# Altium project Obscurum-MB_1a.PrjPcb
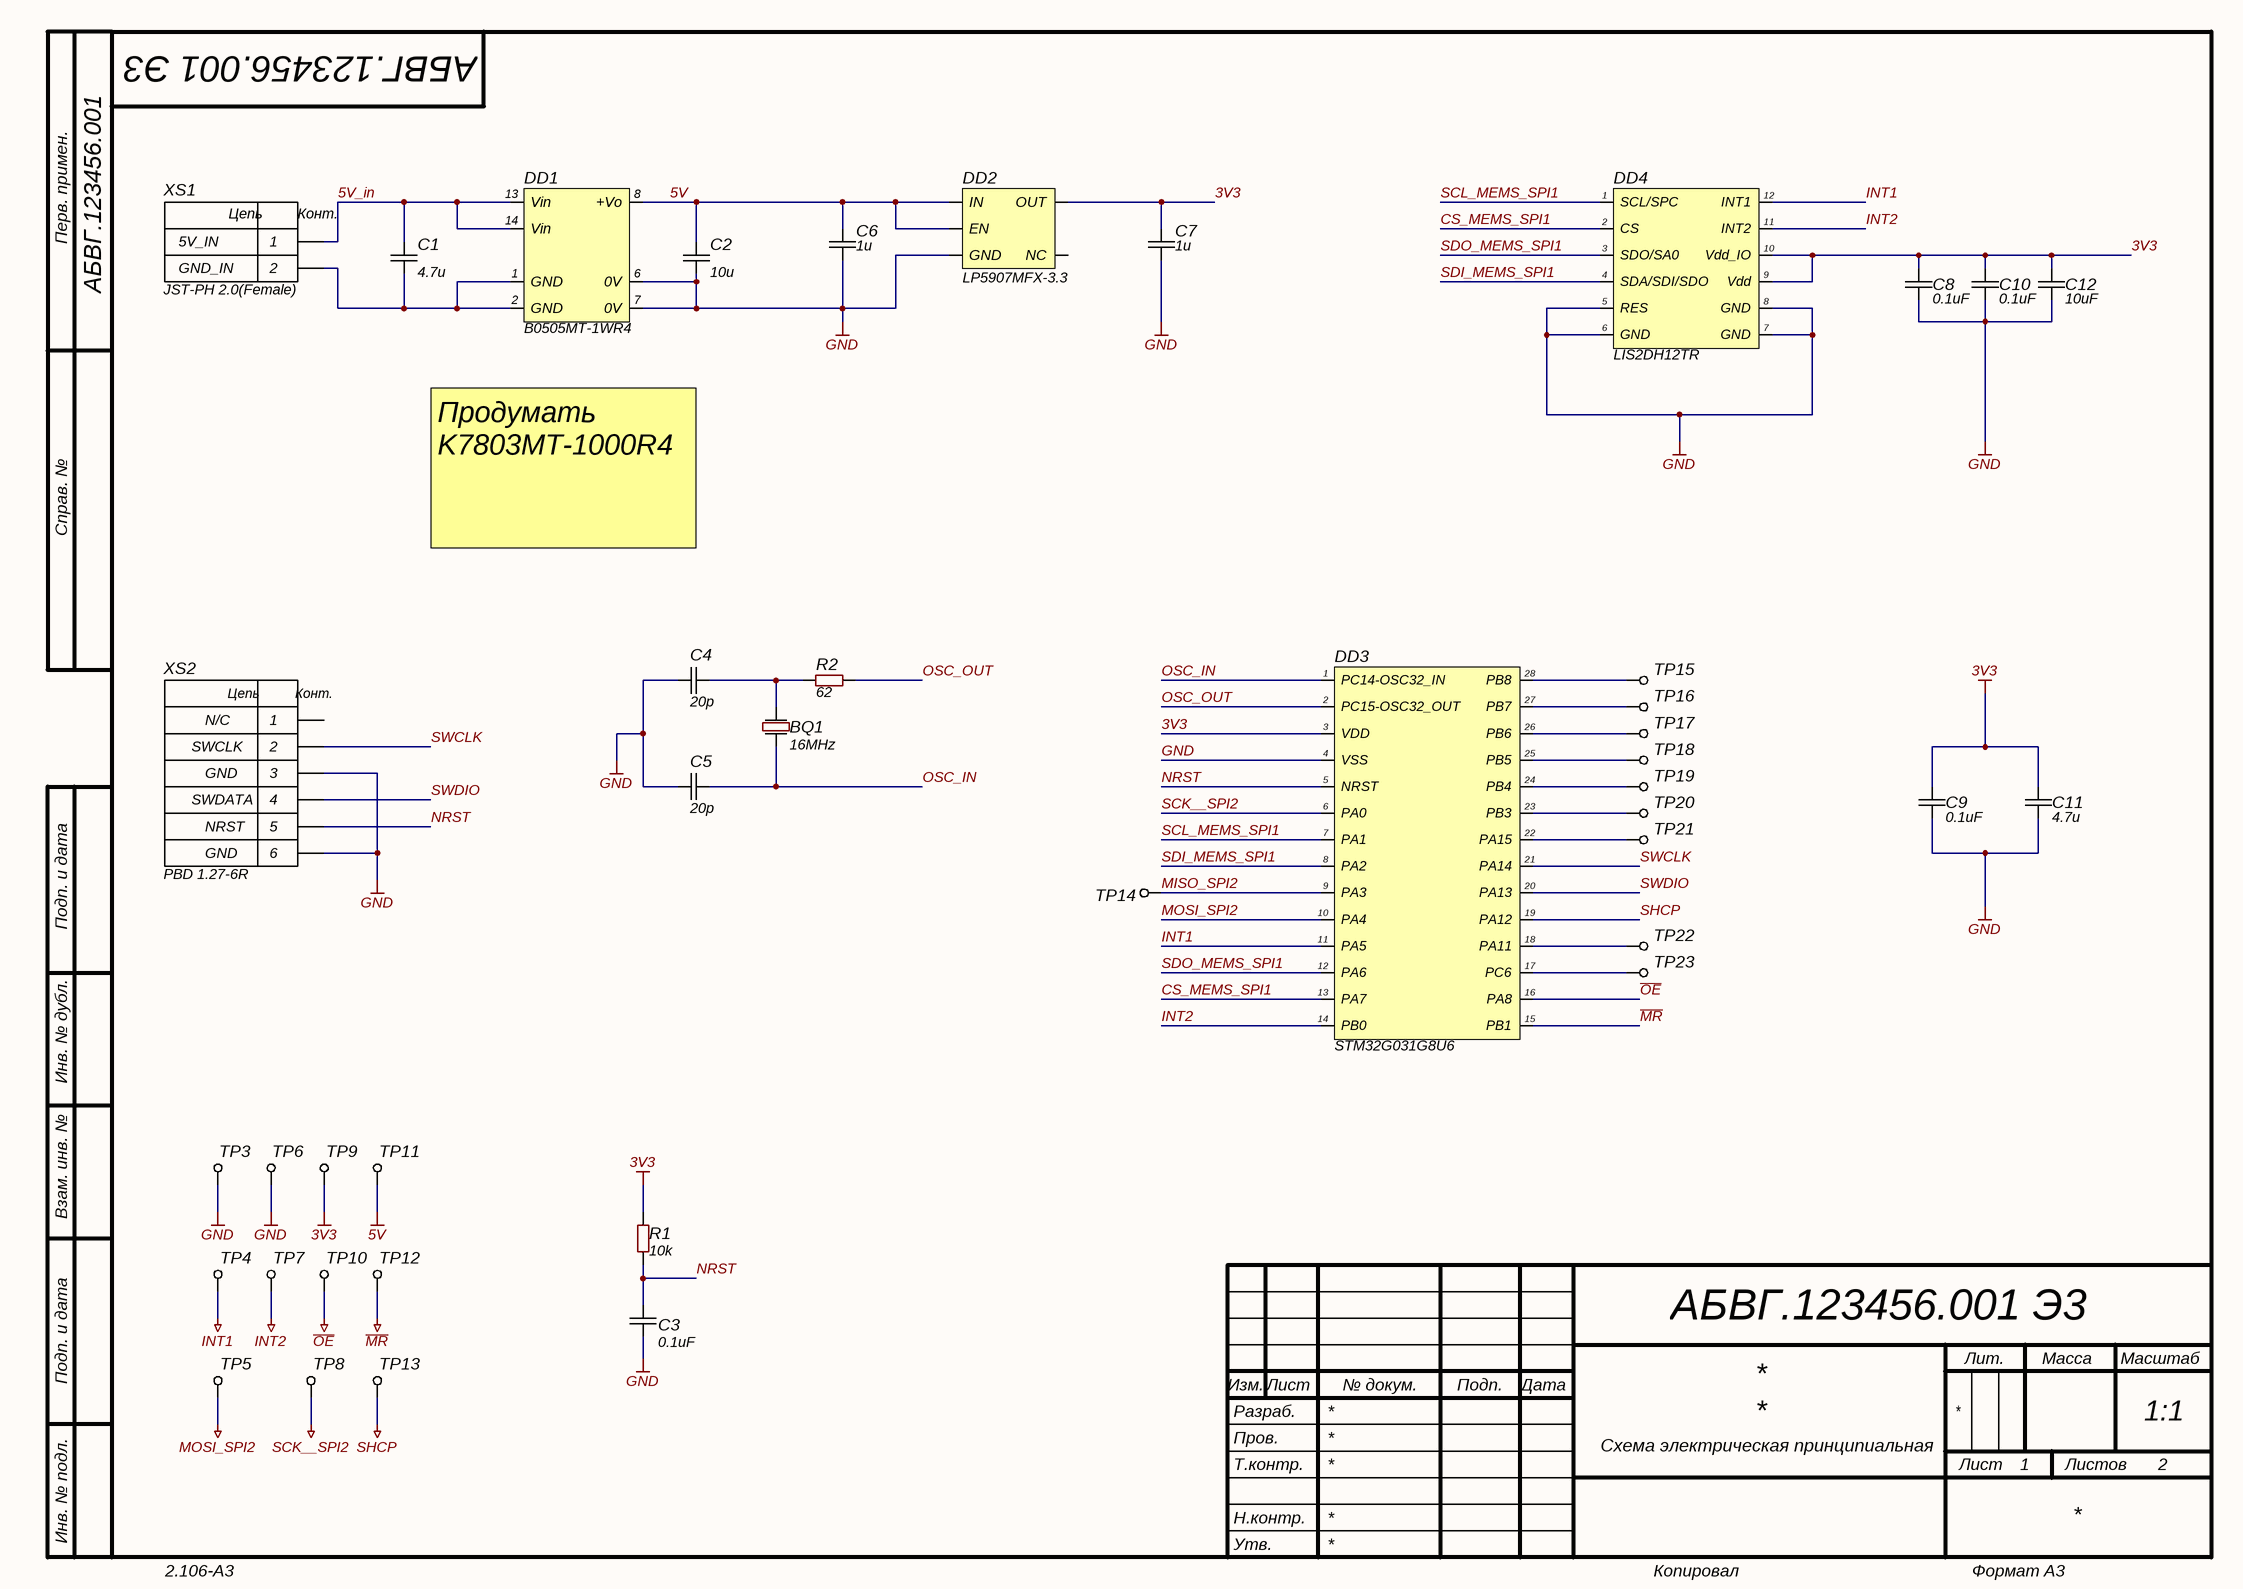
[diagram p0: PWR_MCU.SchDoc]
2 sheets, 135 parts. Net scope: global (net labels, ports and power ports of the same name join across sheets).
Board file: Obscurum-MB_1a.PcbDoc
Sheets:
  PWR_MCU.SchDoc
  LED.SchDoc

## Sheet PWR_MCU.SchDoc
size 420 x 297 mm; Address1: Address1; Address2: Address2; Address3: Address3; Address4: Address4; DocumentNumber: АБВГ.123456.001 Э3; SheetNumber: 1; SheetTotal: 2; Scale: 1:1; DocumentType: Схема электрическая принципиальная; FirstReferrence: АБВГ.123456.001

### Parts
BQ1  Frequency: 16MHz  [OSC: 3225]  (hidden comment: SMD3225-16.000MHz)
C1  value 4.7u  [CAP: 0805]
C2  value 10u  [CAP: 0805]
C3  value 0.1uF  [CAP: 0603]
C4  value 20p  [CAP: 0603]  (hidden comment: 0603   20 пФ ± 10 % X7R 10В)
C5  value 20p  [CAP: 0603]  (hidden comment: 0603   20 пФ ± 10 % X7R 10В)
C6  value 1u  [CAP: 0603]  (hidden comment: 0603   1 мкФ ± 10 % X7R 16В)
C7  value 1u  [CAP: 0603]  (hidden comment: 0603   1 мкФ ± 10 % X7R 16В)
C8  value 0.1uF  [CAP: 0603]
C9  value 0.1uF  [CAP: 0603]
C10  value 0.1uF  [CAP: 0603]
C11  value 4.7u  [CAP: 0603]
C12  value 10uF  [CAP: 0603]
DD1  B0505MT-1WR4  [B0505MT-1WR4]
DD2  LP5907MFX-3.3  [SOT23-5]
DD3  STM32G031G8U6  [28-UFQFPN]
DD4  LIS2DH12TR  [12-LGA]
R1  value 10k  [RES: 0603]
R2  value 62  [RES: 0603]  (hidden comment: 0603 62 Ом ± 5 %)
TP3  Testpoint_HS1mm  [TestPoint(without hole)]  (value not drawn)
TP4  Testpoint_HS1mm  [TestPoint(without hole)]  (value not drawn)
TP5  Testpoint_HS1mm  [TestPoint(without hole)]  (value not drawn)
TP6  Testpoint_HS1mm  [TestPoint(without hole)]  (value not drawn)
TP7  Testpoint_HS1mm  [TestPoint(without hole)]  (value not drawn)
TP8  Testpoint_HS1mm  [TestPoint(without hole)]  (value not drawn)
TP9  Testpoint_HS1mm  [TestPoint(without hole)]  (value not drawn)
TP10  Testpoint_HS1mm  [TestPoint(without hole)]  (value not drawn)
TP11  Testpoint_HS1mm  [TestPoint(without hole)]  (value not drawn)
TP12  Testpoint_HS1mm  [TestPoint(without hole)]  (value not drawn)
TP13  Testpoint_HS1mm  [TestPoint(without hole)]  (value not drawn)
TP14  Testpoint_HS1mm  [TestPoint(without hole)]  (value not drawn)
TP15  Testpoint_HS1mm  [TestPoint(without hole)]  (value not drawn)
TP16  Testpoint_HS1mm  [TestPoint(without hole)]  (value not drawn)
TP17  Testpoint_HS1mm  [TestPoint(without hole)]  (value not drawn)
TP18  Testpoint_HS1mm  [TestPoint(without hole)]  (value not drawn)
TP19  Testpoint_HS1mm  [TestPoint(without hole)]  (value not drawn)
TP20  Testpoint_HS1mm  [TestPoint(without hole)]  (value not drawn)
TP21  Testpoint_HS1mm  [TestPoint(without hole)]  (value not drawn)
TP22  Testpoint_HS1mm  [TestPoint(without hole)]  (value not drawn)
TP23  Testpoint_HS1mm  [TestPoint(without hole)]  (value not drawn)
XS1  JST-PH 2.0(Female)  [JST-PH 2.0(Female)]
XS2  PBD 1.27-6R  [CON: PLLD-6R(1.27)]

### Nets
3V3: C7.2 C8.2 C9.2 C10.2 C11.2 C12.2 DD2.5(OUT) DD3.3(VDD) DD4.9(Vdd) DD4.10(Vdd_IO) R1.2 TP9.1
5V: C2.2 C6.2 DD1.8(+Vo) DD2.1(IN) DD2.3(EN) TP11.1
GND: C2.1 C3.1 C4.2 C5.2 C6.1 C7.1 C8.1 C9.1 C10.1 C11.1 C12.1 DD1.6(0V) DD1.7(0V) DD2.2(GND) DD3.4(VSS) DD4.5(RES) DD4.6(GND) DD4.7(GND) DD4.8(GND) TP3.1 TP6.1 XS2.3 XS2.6
INT1: DD3.11(PA5) DD4.12(INT1) TP4.1
INT2: DD3.14(PB0) DD4.11(INT2) TP7.1
~{MR}: DD3.15(PB1) TP12.1
MOSI_SPI2: DD3.10(PA4) TP5.1
~{OE}: DD3.16(PA8) TP10.1
SCK__SPI2: DD3.6(PA0) TP8.1
SHCP: DD3.19(PA12) TP13.1
5V_in: C1.2 DD1.13(Vin) DD1.14(Vin) XS1.1
CS_MEMS_SPI1: DD3.13(PA7) DD4.2(CS)
MISO_SPI2: DD3.9(PA3) TP14.1
NRST: C3.2 DD3.5(NRST) R1.1 XS2.5
OSC_IN: BQ1.1 C5.1 DD3.1(PC14-OSC32_IN)
OSC_OUT: DD3.2(PC15-OSC32_OUT) R2.1
SCL_MEMS_SPI1: DD3.7(PA1) DD4.1(SCL/SPC)
SDI_MEMS_SPI1: DD3.8(PA2) DD4.4(SDA/SDI/SDO)
SDO_MEMS_SPI1: DD3.12(PA6) DD4.3(SDO/SA0)
SWCLK: DD3.21(PA14) XS2.2
SWDIO: DD3.20(PA13) XS2.4
NetBQ1_3: BQ1.3 C4.1 R2.2
NetC1_1: C1.1 DD1.1(GND) DD1.2(GND) XS1.2
NetDD3_17: DD3.17(PC6) TP23.1
NetDD3_18: DD3.18(PA11) TP22.1
NetDD3_22: DD3.22(PA15) TP21.1
NetDD3_23: DD3.23(PB3) TP20.1
NetDD3_24: DD3.24(PB4) TP19.1
NetDD3_25: DD3.25(PB5) TP18.1
NetDD3_26: DD3.26(PB6) TP17.1
NetDD3_27: DD3.27(PB7) TP16.1
NetDD3_28: DD3.28(PB8) TP15.1

Not connected (* = marked no-connect by the designer): DD2 4(NC); XS2 1

### Notes on the sheet
- 5V_IN
- GND_IN
- Продумать K7803MT-1000R4
- N/C
- SWCLK
- SWDATA
- GND
- NRST
- Перв. примен.
- Справ. №
- Подп. и дата
- Инв. № дубл.
- Взам. инв. №
- Разраб.
- Изм.
- Лист
- № докум.
- Подп.
- Дата
- Лит.
- Масса
- Масштаб
- Пров.
- Т.контр.
- Листов
- Инв. № подл.
- Утв.
- Н.контр.
- 2.106-A3
- Копировал
- Формат А3
- (in symbol JST-PH 2.0(Female)) Цепь; Конт.
- (in symbol PBD 1.27-6R) Цепь; Конт.

### Library data of the parts
BQ1 = Crystal_3225: Resonator; Manufacturer: Diodes Incorporated; PartNumber: FL1000002; ValueManufacturerPartNumber: Crystal, 16MHz, 12pF, ±25ppm, case 3225, -40...+85°C; LoadCapacitance: 12pF; Tolerance: ±25ppm; Package: case 3225; HelpURL: https://www.digikey.com/product-detail/en/diodes-incorporated/FL1000002/FL1000002CT-ND/6042078; Temperature: -40...+85°C; TypeOscilator: Crystal
C1 = Ceramic_0805: Manufacturer: Yageo; PartNumber: CC0805KRX7R7BB104; ValueManufacturerPartNumber: Ceramic capacitor, 4.7u, X7R, ±10%, 50V, 0805, -55...+125°C; TypeCapacitor: Ceramic capacitor; Tolerance: ±10%; TypeDielectric: X7R; Voltage: 50V; Package: 0805; HelpURL: https://www.digikey.com/product-detail/en/yageo/CC0805KRX7R7BB104/311-1142-1-ND/303052; Temperature: -55...+125°C
C2 = Ceramic_0805: Manufacturer: Yageo; PartNumber: CC0805KRX7R7BB104; ValueManufacturerPartNumber: Ceramic capacitor, 10u, X7R, ±10%, 50V, 0805, -55...+125°C; TypeCapacitor: Ceramic capacitor; Tolerance: ±10%; TypeDielectric: X7R; Voltage: 50V; Package: 0805; HelpURL: https://www.digikey.com/product-detail/en/yageo/CC0805KRX7R7BB104/311-1142-1-ND/303052; Temperature: -55...+125°C
C3 C8-C10 = Ceramic_0603: Manufacturer: Yageo; PartNumber: CC0603KRX7R7BB104; ValueManufacturerPartNumber: Ceramic capacitor, 0.1uF, X7R, ±10%, 16V, 0603, -55...+125°C; TypeCapacitor: Ceramic capacitor; Tolerance: ±10%; TypeDielectric: X7R; Voltage: 16V; Package: 0603; HelpURL: https://www.digikey.com/product-detail/en/yageo/CC0603KRX7R7BB104/311-1088-1-ND/302998; Temperature: -55...+125°C
C4 C5 = Ceramic_0603: Capacitor; Manufacturer: Yageo; PartNumber: CC0603KRX7R7BB104; ValueManufacturerPartNumber: Ceramic capacitor, 20p, X7R, ±10%, 16V, 0603, -55...+125°C; TypeCapacitor: Ceramic capacitor; Tolerance: ±10%; Voltage: 16V; Package: 0603; HelpURL: https://www.digikey.com/product-detail/en/yageo/CC0603KRX7R7BB104/311-1088-1-ND/302998; Temperature: -55...+125°C; TypeDielectric: X7R
C6 C7 = Ceramic_0603: Capacitor; Manufacturer: Yageo; PartNumber: CC0603KRX7R7BB104; ValueManufacturerPartNumber: Ceramic capacitor, 1u, X7R, ±10%, 16V, 0603, -55...+125°C; TypeCapacitor: Ceramic capacitor; Tolerance: ±10%; Voltage: 16V; Package: 0603; HelpURL: https://www.digikey.com/product-detail/en/yageo/CC0603KRX7R7BB104/311-1088-1-ND/302998; Temperature: -55...+125°C; TypeDielectric: X7R
C11 = Ceramic_0603: Manufacturer: Yageo; PartNumber: CC0603KRX7R7BB104; ValueManufacturerPartNumber: Ceramic capacitor, 4.7u, X7R, ±10%, 16V, 0603, -55...+125°C; TypeCapacitor: Ceramic capacitor; Tolerance: ±10%; TypeDielectric: X7R; Voltage: 16V; Package: 0603; HelpURL: https://www.digikey.com/product-detail/en/yageo/CC0603KRX7R7BB104/311-1088-1-ND/302998; Temperature: -55...+125°C
C12 = Ceramic_0603: Manufacturer: Yageo; PartNumber: CC0603KRX7R7BB104; ValueManufacturerPartNumber: Ceramic capacitor, 10uF, X7R, ±10%, 16V, 0603, -55...+125°C; TypeCapacitor: Ceramic capacitor; Tolerance: ±10%; TypeDielectric: X7R; Voltage: 16V; Package: 0603; HelpURL: https://www.digikey.com/product-detail/en/yageo/CC0603KRX7R7BB104/311-1088-1-ND/302998; Temperature: -55...+125°C
DD1 = B0505MT-1WR4: Isolated DC-DC converter; ComponentLink1Description: Datasheet; ComponentLink1URL: https://www.mornsunpower.ru/html/pdf/B0505MT-1WR4.html
DD2 = LP5907MFX-3.3: LDO; ComponentLink1Description: Datasheet; ComponentLink1URL: https://www.ti.com/lit/ds/symlink/lp5907.pdf?ts=1629438025263&ref_url=https%253A%252F%252Fwww.google.com%252F
DD3 = STM32G031G8U6: Cortex-M0+; ComponentLink1Description: Documentation; ComponentLink1URL: https://www.st.com/en/microcontrollers-microprocessors/stm32g031g8.html
DD4 = LIS2DH12TR: MEMS accelerometer; ComponentLink1Description: Datasheet; ComponentLink1URL: https://estore.st.com/en/lis2dh12tr-cpn.html
R1 = Resistor_0603: Manufacturer: Yageo; PartNumber: RC0603JR-07100RL; TypeResistor: Resistor film; Power: 0.1W; Package: 0603; HelpURL: https://www.digikey.com/product-detail/en/yageo/RC0603JR-07100RL/311-100GRCT-ND/729644; ValueManufacturerPartNumber: =TypeResistor+', '+Value+', '+Tolerance+', '+Package+', '+Power+', '+Temperature; Temperature: -55...+125°C
R2 = Resistor_0603: Resistor; Manufacturer: Yageo; PartNumber: RC0603JR-07100RL; ValueManufacturerPartNumber: Resistor film, 62, ±5%, 0603, 0.1W, -55...+125°C; TypeResistor: Resistor film; Power: 0.1W; Tolerance: ±5%; Package: 0603; HelpURL: https://www.digikey.com/product-detail/en/yageo/RC0603JR-07100RL/311-100GRCT-ND/729644; Temperature: -55...+125°C
XS2 = PBD 1.27-6R: DS1065-14-2X3S8BR

## Sheet LED.SchDoc
size 594 x 420 mm; Address1: Address1; Address2: Address2; Address3: Address3; Address4: Address4; DocumentNumber: АБВГ.123456.001 Э3; SheetNumber: 2; SheetTotal: 2; Scale: 1:1; DocumentType: Схема электрическая принципиальная; FirstReferrence: АБВГ.123456.001
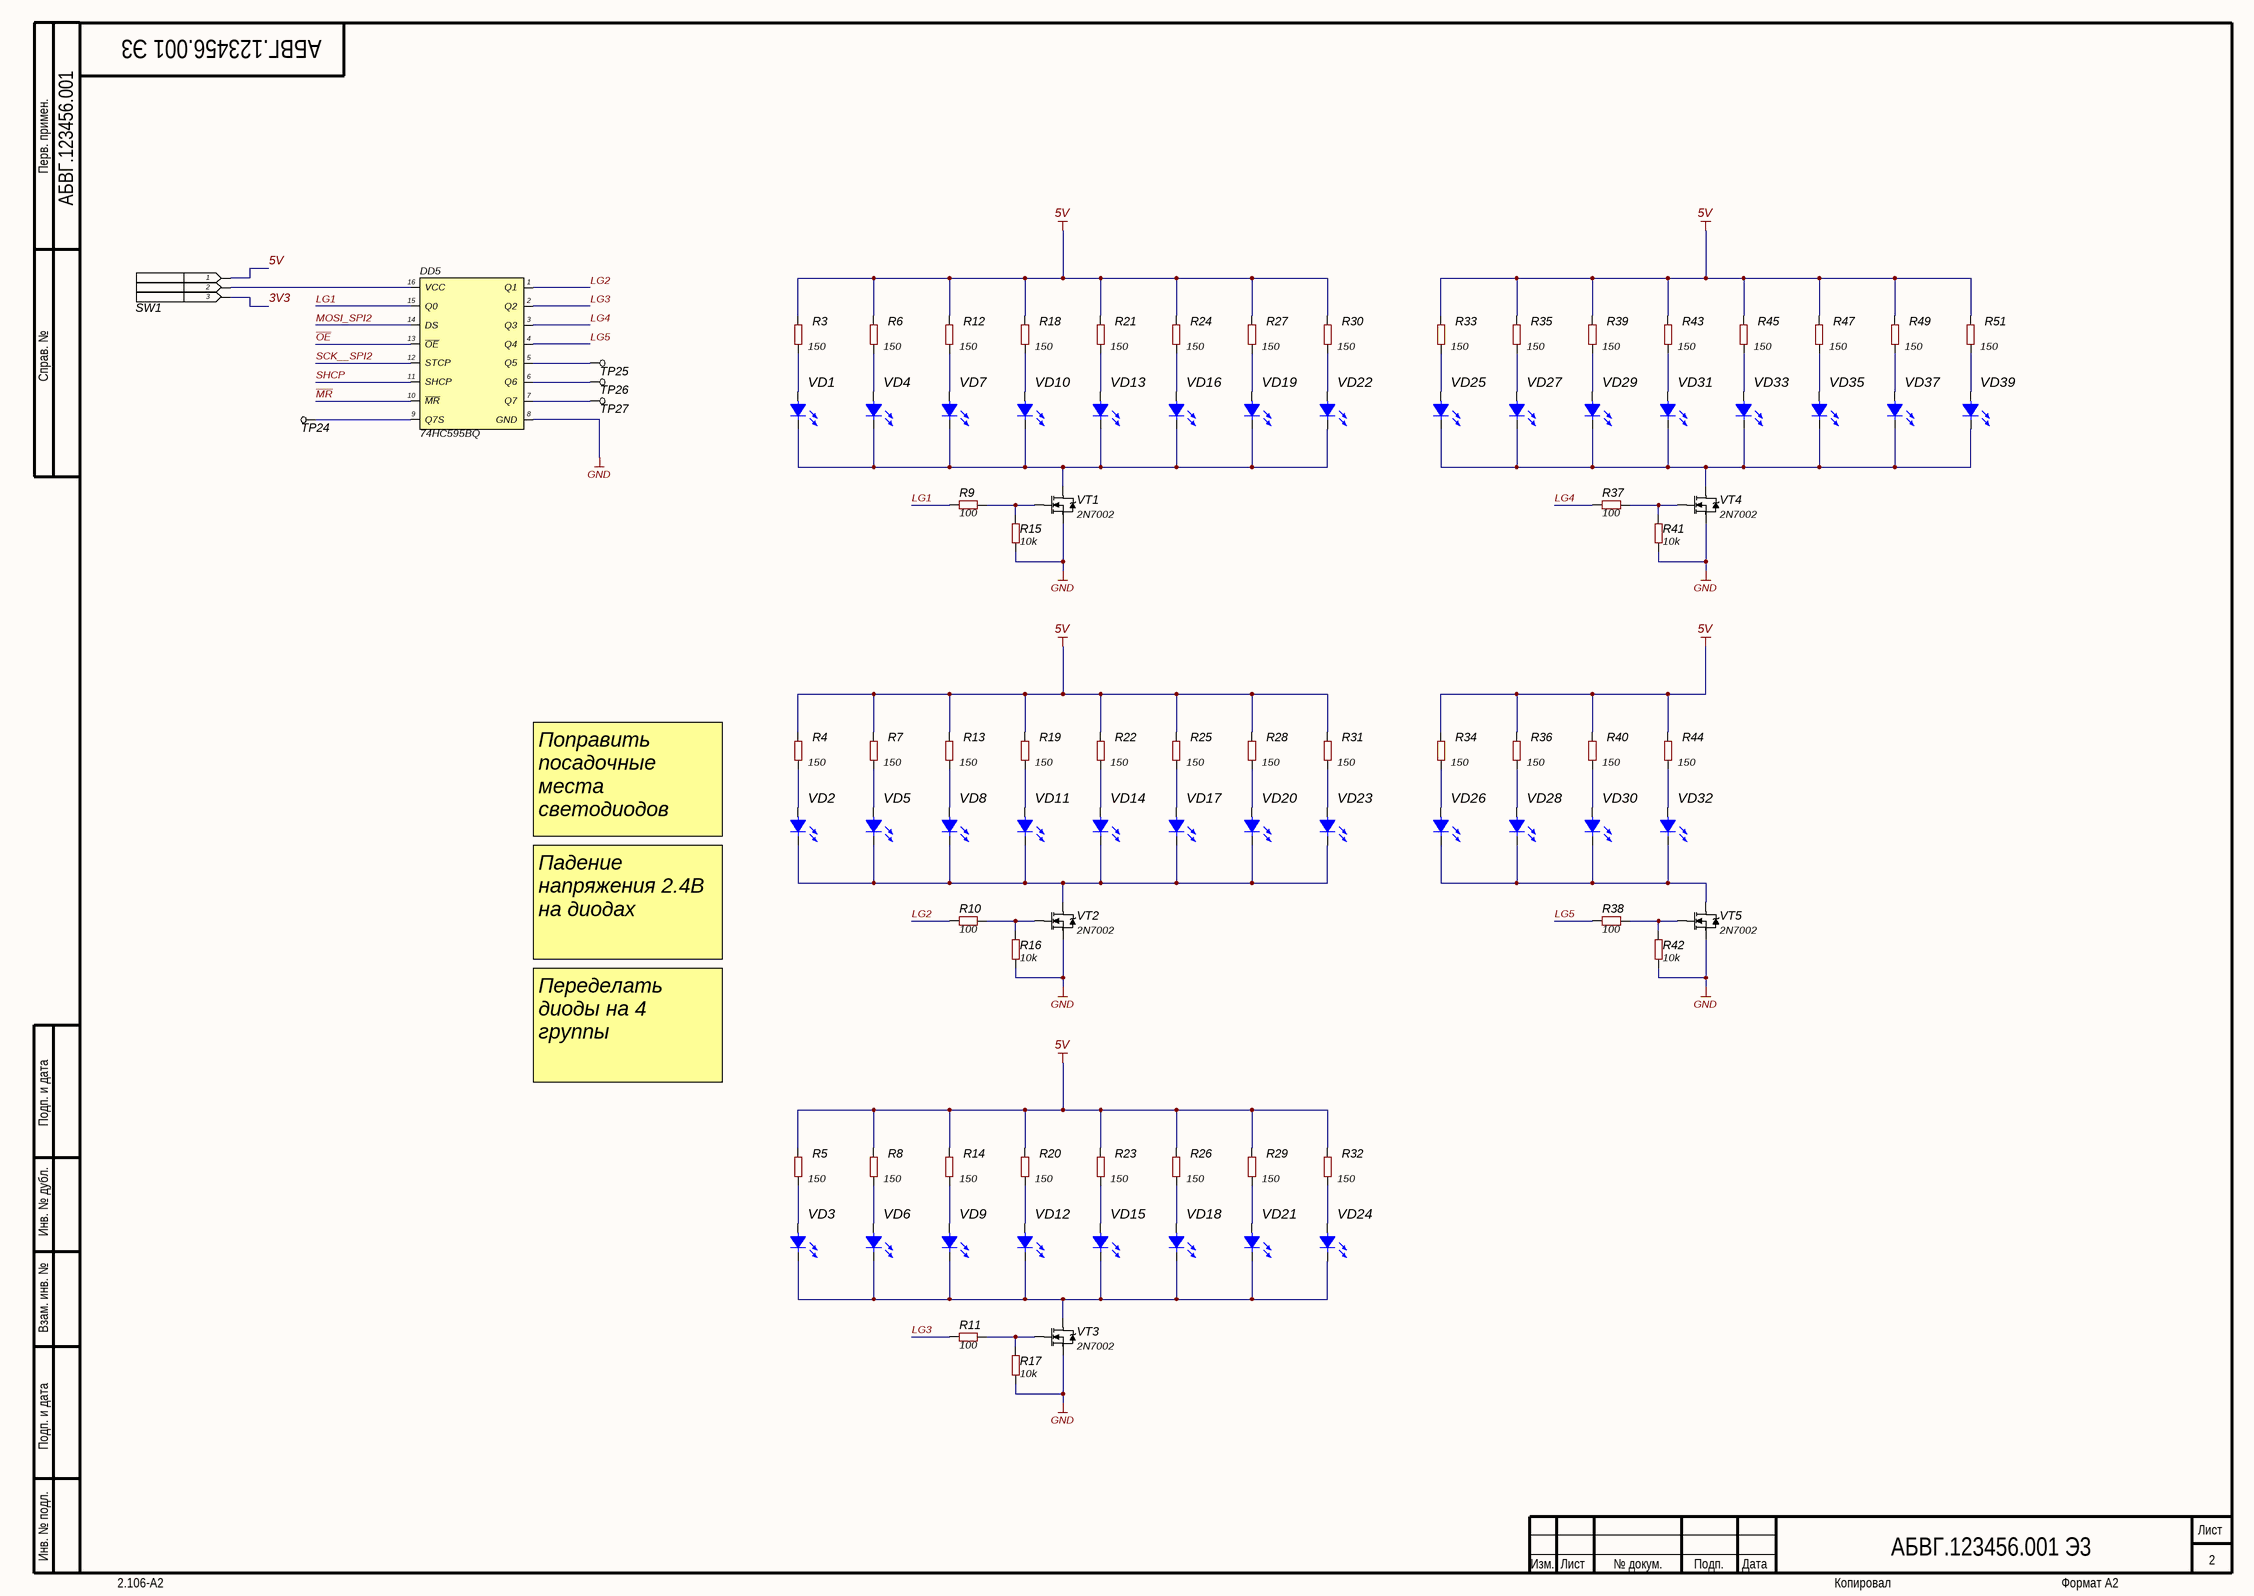
[diagram p1: LED.SchDoc]

### Parts
DD5  74HC595BQ  [16-DHVQFN]
R3  value 150  [RES: 0603]
R4  value 150  [RES: 0603]
R5  value 150  [RES: 0603]
R6  value 150  [RES: 0603]
R7  value 150  [RES: 0603]
R8  value 150  [RES: 0603]
R9  value 100  [RES: 0603]
R10  value 100  [RES: 0603]
R11  value 100  [RES: 0603]
R12  value 150  [RES: 0603]
R13  value 150  [RES: 0603]
R14  value 150  [RES: 0603]
R15  value 10k  [RES: 0603]
R16  value 10k  [RES: 0603]
R17  value 10k  [RES: 0603]
R18  value 150  [RES: 0603]
R19  value 150  [RES: 0603]
R20  value 150  [RES: 0603]
R21  value 150  [RES: 0603]
R22  value 150  [RES: 0603]
R23  value 150  [RES: 0603]
R24  value 150  [RES: 0603]
R25  value 150  [RES: 0603]
R26  value 150  [RES: 0603]
R27  value 150  [RES: 0603]
R28  value 150  [RES: 0603]
R29  value 150  [RES: 0603]
R30  value 150  [RES: 0603]
R31  value 150  [RES: 0603]
R32  value 150  [RES: 0603]
R33  value 150  [RES: 0603]
R34  value 150  [RES: 0603]
R35  value 150  [RES: 0603]
R36  value 150  [RES: 0603]
R37  value 100  [RES: 0603]
R38  value 100  [RES: 0603]
R39  value 150  [RES: 0603]
R40  value 150  [RES: 0603]
R41  value 10k  [RES: 0603]
R42  value 10k  [RES: 0603]
R43  value 150  [RES: 0603]
R44  value 150  [RES: 0603]
R45  value 150  [RES: 0603]
R47  value 150  [RES: 0603]
R49  value 150  [RES: 0603]
R51  value 150  [RES: 0603]
SW1  Jumper  [JUM: 0603_3P]  (value not drawn)
TP24  Testpoint_HS1mm  [TestPoint(without hole)]  (value not drawn)
TP25  Testpoint_HS1mm  [TestPoint(without hole)]  (value not drawn)
TP26  Testpoint_HS1mm  [TestPoint(without hole)]  (value not drawn)
TP27  Testpoint_HS1mm  [TestPoint(without hole)]  (value not drawn)
VD1  (no value)  [LED: 1206Y]
VD2  (no value)  [LED: 1206Y]
VD3  (no value)  [LED: 1206Y]
VD4  (no value)  [LED: 1206Y]
VD5  (no value)  [LED: 1206Y]
VD6  (no value)  [LED: 1206Y]
VD7  (no value)  [LED: 1206Y]
VD8  (no value)  [LED: 1206Y]
VD9  (no value)  [LED: 1206Y]
VD10  (no value)  [LED: 1206Y]
VD11  (no value)  [LED: 1206Y]
VD12  (no value)  [LED: 1206Y]
VD13  (no value)  [LED: 1206Y]
VD14  (no value)  [LED: 1206Y]
VD15  (no value)  [LED: 1206Y]
VD16  (no value)  [LED: 1206Y]
VD17  (no value)  [LED: 1206Y]
VD18  (no value)  [LED: 1206Y]
VD19  (no value)  [LED: 1206Y]
VD20  (no value)  [LED: 1206Y]
VD21  (no value)  [LED: 1206Y]
VD22  (no value)  [LED: 1206Y]
VD23  (no value)  [LED: 1206Y]
VD24  (no value)  [LED: 1206Y]
VD25  (no value)  [LED: 1206Y]
VD26  (no value)  [LED: 1206Y]
VD27  (no value)  [LED: 1206Y]
VD28  (no value)  [LED: 1206Y]
VD29  (no value)  [LED: 1206Y]
VD30  (no value)  [LED: 1206Y]
VD31  (no value)  [LED: 1206Y]
VD32  (no value)  [LED: 1206Y]
VD33  (no value)  [LED: 1206Y]
VD35  (no value)  [LED: 1206Y]
VD37  (no value)  [LED: 1206Y]
VD39  (no value)  [LED: 1206Y]
VT1  PartNumber: 2N7002  [SOT23]
VT2  PartNumber: 2N7002  [SOT23]
VT3  PartNumber: 2N7002  [SOT23]
VT4  PartNumber: 2N7002  [SOT23]
VT5  PartNumber: 2N7002  [SOT23]

### Nets
3V3: SW1.3
5V: R3.2 R4.2 R5.2 R6.2 R7.2 R8.2 R12.2 R13.2 R14.2 R18.2 R19.2 R20.2 R21.2 R22.2 R23.2 R24.2 R25.2 R26.2 R27.2 R28.2 R29.2 R30.2 R31.2 R32.2 R33.2 R34.2 R35.2 R36.2 R39.2 R40.2 R43.2 R44.2 R45.2 R47.2 R49.2 R51.2 SW1.1
GND: DD5.8(GND) R15.1 R16.1 R17.1 R41.1 R42.1 VT1.2(S) VT2.2(S) VT3.2(S) VT4.2(S) VT5.2(S)
~{MR}: DD5.10(~{MR})
MOSI_SPI2: DD5.14(DS)
~{OE}: DD5.13(~{OE})
SCK__SPI2: DD5.12(STCP)
SHCP: DD5.11(SHCP)
LG1: DD5.15(Q0) R9.1
LG2: DD5.1(Q1) R10.1
LG3: DD5.2(Q2) R11.1
LG4: DD5.3(Q3) R37.1
LG5: DD5.4(Q4) R38.1
NetDD5_5: DD5.5(Q5) TP25.1
NetDD5_6: DD5.6(Q6) TP26.1
NetDD5_7: DD5.7(Q7) TP27.1
NetDD5_9: DD5.9(Q7S) TP24.1
NetDD5_16: DD5.16(VCC) SW1.2
NetR3_1: R3.1 VD1.1(A)
NetR4_1: R4.1 VD2.1(A)
NetR5_1: R5.1 VD3.1(A)
NetR6_1: R6.1 VD4.1(A)
NetR7_1: R7.1 VD5.1(A)
NetR8_1: R8.1 VD6.1(A)
NetR9_2: R9.2 R15.2 VT1.1(G)
NetR10_2: R10.2 R16.2 VT2.1(G)
NetR11_2: R11.2 R17.2 VT3.1(G)
NetR12_1: R12.1 VD7.1(A)
NetR13_1: R13.1 VD8.1(A)
NetR14_1: R14.1 VD9.1(A)
NetR18_1: R18.1 VD10.1(A)
NetR19_1: R19.1 VD11.1(A)
NetR20_1: R20.1 VD12.1(A)
NetR21_1: R21.1 VD13.1(A)
NetR22_1: R22.1 VD14.1(A)
NetR23_1: R23.1 VD15.1(A)
NetR24_1: R24.1 VD16.1(A)
NetR25_1: R25.1 VD17.1(A)
NetR26_1: R26.1 VD18.1(A)
NetR27_1: R27.1 VD19.1(A)
NetR28_1: R28.1 VD20.1(A)
NetR29_1: R29.1 VD21.1(A)
NetR30_1: R30.1 VD22.1(A)
NetR31_1: R31.1 VD23.1(A)
NetR32_1: R32.1 VD24.1(A)
NetR33_1: R33.1 VD25.1(A)
NetR34_1: R34.1 VD26.1(A)
NetR35_1: R35.1 VD27.1(A)
NetR36_1: R36.1 VD28.1(A)
NetR37_2: R37.2 R41.2 VT4.1(G)
NetR38_2: R38.2 R42.2 VT5.1(G)
NetR39_1: R39.1 VD29.1(A)
NetR40_1: R40.1 VD30.1(A)
NetR43_1: R43.1 VD31.1(A)
NetR44_1: R44.1 VD32.1(A)
NetR45_1: R45.1 VD33.1(A)
NetR47_1: R47.1 VD35.1(A)
NetR49_1: R49.1 VD37.1(A)
NetR51_1: R51.1 VD39.1(A)
NetVD1_2: VD1.2(C) VD4.2(C) VD7.2(C) VD10.2(C) VD13.2(C) VD16.2(C) VD19.2(C) VD22.2(C) VT1.3(D)
NetVD2_2: VD2.2(C) VD5.2(C) VD8.2(C) VD11.2(C) VD14.2(C) VD17.2(C) VD20.2(C) VD23.2(C) VT2.3(D)
NetVD3_2: VD3.2(C) VD6.2(C) VD9.2(C) VD12.2(C) VD15.2(C) VD18.2(C) VD21.2(C) VD24.2(C) VT3.3(D)
NetVD25_2: VD25.2(C) VD27.2(C) VD29.2(C) VD31.2(C) VD33.2(C) VD35.2(C) VD37.2(C) VD39.2(C) VT4.3(D)
NetVD26_2: VD26.2(C) VD28.2(C) VD30.2(C) VD32.2(C) VT5.3(D)

### Notes on the sheet
- Поправить посадочные места светодиодов
- Падение напряжения 2.4В на диодах
- Переделать диоды на 4 группы
- Перв. примен.
- Справ. №
- Подп. и дата
- Инв. № дубл.
- Взам. инв. №
- Инв. № подл.
- Изм.
- Лист
- № докум.
- Подп.
- Дата
- 2.106-A2
- Копировал
- Формат А2

### Library data of the parts
R3-R45 R47 R49 R51 = Resistor_0603: as R1 on sheet PWR_MCU; Package: 0603; HelpURL: https://www.digikey.com/product-detail/en/yageo/RC0603JR-07100RL/311-100GRCT-ND/729644; ValueManufacturerPartNumber: =TypeResistor+', '+Value+', '+Tolerance+', '+Package+', '+Power+', '+Temperature; Temperature: -55...+125°C
SW1 = Jumper: N/C
VD1-VD33 VD35 VD37 VD39 = LED_single: ValueManufacturerPartNumber: LED, Green, *, *, *, -55...+150°C; TypeDiode: LED; ColorParameter: Green; Manufacturer: *; Package: *; HelpURL: *; Temperature: -55...+150°C; Current: *; VoltageDrop: *; PartNumber: *; Color: GREEN
VT1-VT5 = MOSFET_N_132: Manufacturer: Infineon Technologies; ValueManufacturerPartNumber: MOSFET N-channel transistor, 80V, 7A, 9.1nC, 2.5W, 34mOhm, 756pF, 8-TDSON, -55...+150°C; TypeTransistor: MOSFET N-channel transistor; VoltageDS: 80V; CurrentDS: 7A; RDS: 34mOhm; GateCharge: 9.1nC; InputCapacitor: 756pF; MaxPower: 2.5W; Package: 8-TDSON; HelpURL: https://www.digikey.com/product-detail/en/infineon-technologies/BSC340N08NS3GATMA1/BSC340N08NS3GATMA1TR-ND/2080655; Temperature: -55...+150°C
DD5 = 74HC595BQ: ComponentLink1Description: Information; ComponentLink1URL: https://www.nexperia.com/products/analog-logic-ics/logic/flip-flops-latches-registers-counters-dividers/shift-registers/74HC595BQ.html

## Nets that join several sheets
3V3: PWR_MCU (12 pins), LED (SW1.3)
5V: PWR_MCU (6 pins), LED (37 pins)
GND: PWR_MCU (23 pins), LED (11 pins)
~{MR}: PWR_MCU (DD3.15 TP12.1), LED (DD5.10)
MOSI_SPI2: PWR_MCU (DD3.10 TP5.1), LED (DD5.14)
~{OE}: PWR_MCU (DD3.16 TP10.1), LED (DD5.13)
SCK__SPI2: PWR_MCU (DD3.6 TP8.1), LED (DD5.12)
SHCP: PWR_MCU (DD3.19 TP13.1), LED (DD5.11)